# EAGLE schematic wewit1 (EAGLE 6.4)
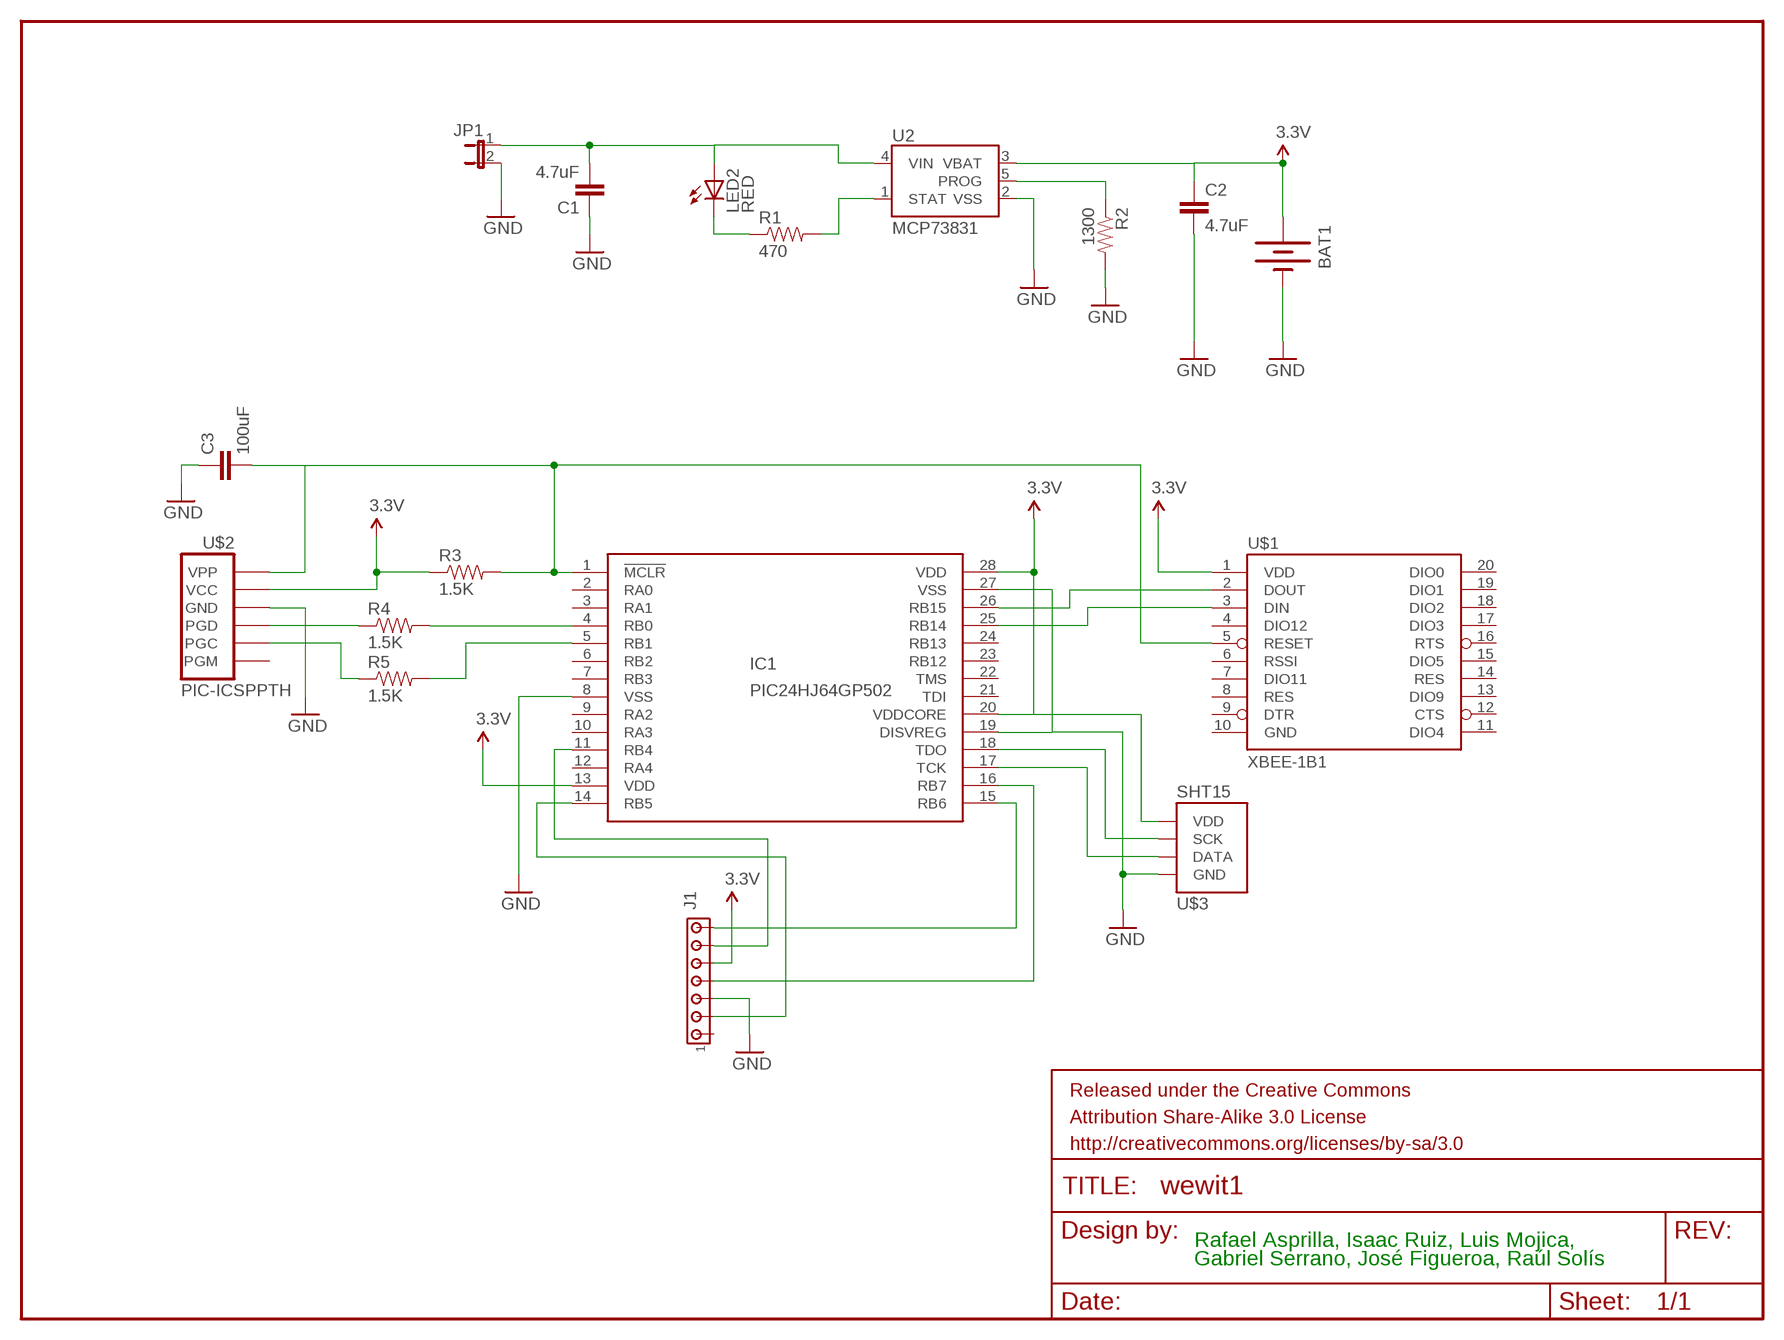
[diagram p0: schematic, sheet 1]

## Parts
BAT1  BATTERYLIPO-TABS  [LIPO-110-TABS]
C1  4.7uF  CAP0402-CAP  [0402-CAP]
C2  4.7uF  CAP0402-CAP  [0402-CAP]
C3  100uF  CAP0402-CAP  [0402-CAP]
FRAME1  FRAME-LETTER  [CREATIVE_COMMONS]
IC1  PIC24HJ64GP502  PIC24FJ64GA002  [DIL28-3]
J1  MTA07-100  [10X07MTA]
JP1  JUMPER-2PTH  [1X02]
LED2  RED  LED0603  [LED-0603]
R1  470  RESISTOR0402-RES  [0402-RES]
R2  1300  RESISTORAXIAL-0.3  [AXIAL-0.3]
R3  1.5K  RESISTORAXIAL-0.3  [AXIAL-0.3]
R4  1.5K  RESISTORAXIAL-0.3  [AXIAL-0.3]
R5  1.5K  RESISTORAXIAL-0.3  [AXIAL-0.3]
U2  MCP73831  [SOT23-5]
U$1  XBEE-1B1  [XBEE-1]
U$2  PIC-ICSPPTH  [MOLEX-1X6]
U$3  SHT15  SHT1XSMD  [SHT1X]

## Nets
3.3V: BAT1.+ C2.1 IC1.13(VDD) IC1.20(VDDCORE) IC1.28(VDD) J1.5 R3.P$1 U2.3(VBAT) U$1.1(VDD) U$2.5(VCC) U$3.4(VDD)
GND: BAT1.- C1.1 C2.2 C3.1 IC1.8(VSS) IC1.19(DISVREG) IC1.27(VSS) J1.3 JP1.2 R2.P$2 U2.2(VSS) U$2.4(GND) U$3.1(GND)
N$1: C1.2 JP1.1 LED2.A U2.4(VIN)
N$2: R1.2 U2.1(STAT)
N$3: LED2.C R1.1
N$4: IC1.14(RB5) J1.2
N$5: IC1.26(RB15) U$1.2(DOUT)
N$6: C3.2 IC1.1(!MCLR) R3.P$2 U$1.5(RESET) U$2.6(VPP)
N$7: IC1.15(RB6) J1.7
N$8: IC1.11(RB4) J1.6
N$9: IC1.16(RB7) J1.4
N$10: IC1.25(RB14) U$1.3(DIN)
N$11: R4.P$1 U$2.3(PGD)
N$12: R5.P$1 U$2.2(PGC)
N$13: IC1.4(RB0) R4.P$2
N$14: IC1.5(RB1) R5.P$2
N$15: IC1.18(TDO) U$3.3(SCK)
N$16: IC1.17(TCK) U$3.2(DATA)
PROG: R2.P$1 U2.5(PROG)
Unconnected: IC1.2(RA0) IC1.3(RA1) IC1.6(RB2) IC1.7(RB3) IC1.9(RA2) IC1.10(RA3) IC1.12(RA4) IC1.21(TDI) IC1.22(TMS) IC1.23(RB12) IC1.24(RB13) J1.1 U$1.4(DIO12) U$1.6(RSSI) U$1.7(DIO11) U$1.8(RES) U$1.9(DTR) U$1.11(DIO4) U$1.12(CTS) U$1.13(DIO9) U$1.14(RES) U$1.15(DIO5) U$1.16(RTS) U$1.17(DIO3) U$1.18(DIO2) U$1.19(DIO1) U$1.20(DIO0) U$2.1(PGM)

## Notes on the sheet
- Rafael Asprilla, Isaac Ruiz, Luis Mojica,
  Gabriel Serrano, José Figueroa, Raúl Solís

## Power pins joined to a net without a drawn wire
GND: U$1.10(GND)

## Library data of the parts
BAT1 = SparkFun-Electromechanical:BATTERY: Battery Holders Various common sizes : AA, AAA, 20mm coin cell and 12mm coin cell. 20MM_4LEGS, BATT-10373
C1-C3 = SparkFun:CAP: Capacitor Standard 0603 ceramic capacitor, and 0.1" leaded capacitor.
FRAME1 = SparkFun-Aesthetics:FRAME-LETTER: Schematic Frame Standard 8.5x11 US Letter frame
IC1 = microchip:PIC24FJ64GA002: PIC24FJ64GA002 edit this description Auto generated by make-symbol-device-package-bsdl.ulp Rev. 25 Source: PIC24FJ64GA002.bsd; MPN: PIC24FJ64GA002-I/SP; OC_FARNELL: 1332298; OC_NEWARK: 88K6132
J1 = con-amp:MTA07-100: AMP connector
JP1 = SparkFun-Passives:JUMPER-2: Jumper Basic 0.1" spaced jumper. Use with breakaway headers.
LED2 = SparkFun:LED: LEDs Standard schematic elements and footprints for 5mm, 3mm, 1206, and 0603 sized LEDs. 5mm - Spark Fun Electronics SKU : COM-00529 (and others)
R1 = SparkFun:RESISTOR: Resistor Basic schematic elements and footprints for 0603, 1206, and PTH resistors.
R2-R5 = SparkFun-Passives:RESISTOR: Resistor Basic schematic elements and footprints for 0603, 1206, and PTH resistors.
U2 = SparkFun:MCP73831: Microchip's MCP73831 Miniature single cell, fully integrated Li-Ion, Li-polymer charge management controller http://ww1.microchip.com/downloads/en/DeviceDoc/21984a.pdf
U$1 = SparkFun-RF:XBEE-1: Xbee module footprints SMT header is CONN-09042.
U$2 = SparkFun-Connectors:PIC-ICSP: ISCP Programming connector for UAV, UBW Kit, etc.
U$3 = SparkFun-Sensors:SHT1X: SHT1x Humdity Sensor Sensirion humdity sensor. Schematic element and footprint proven. Spark Fun Electronics SKU : COM-08227